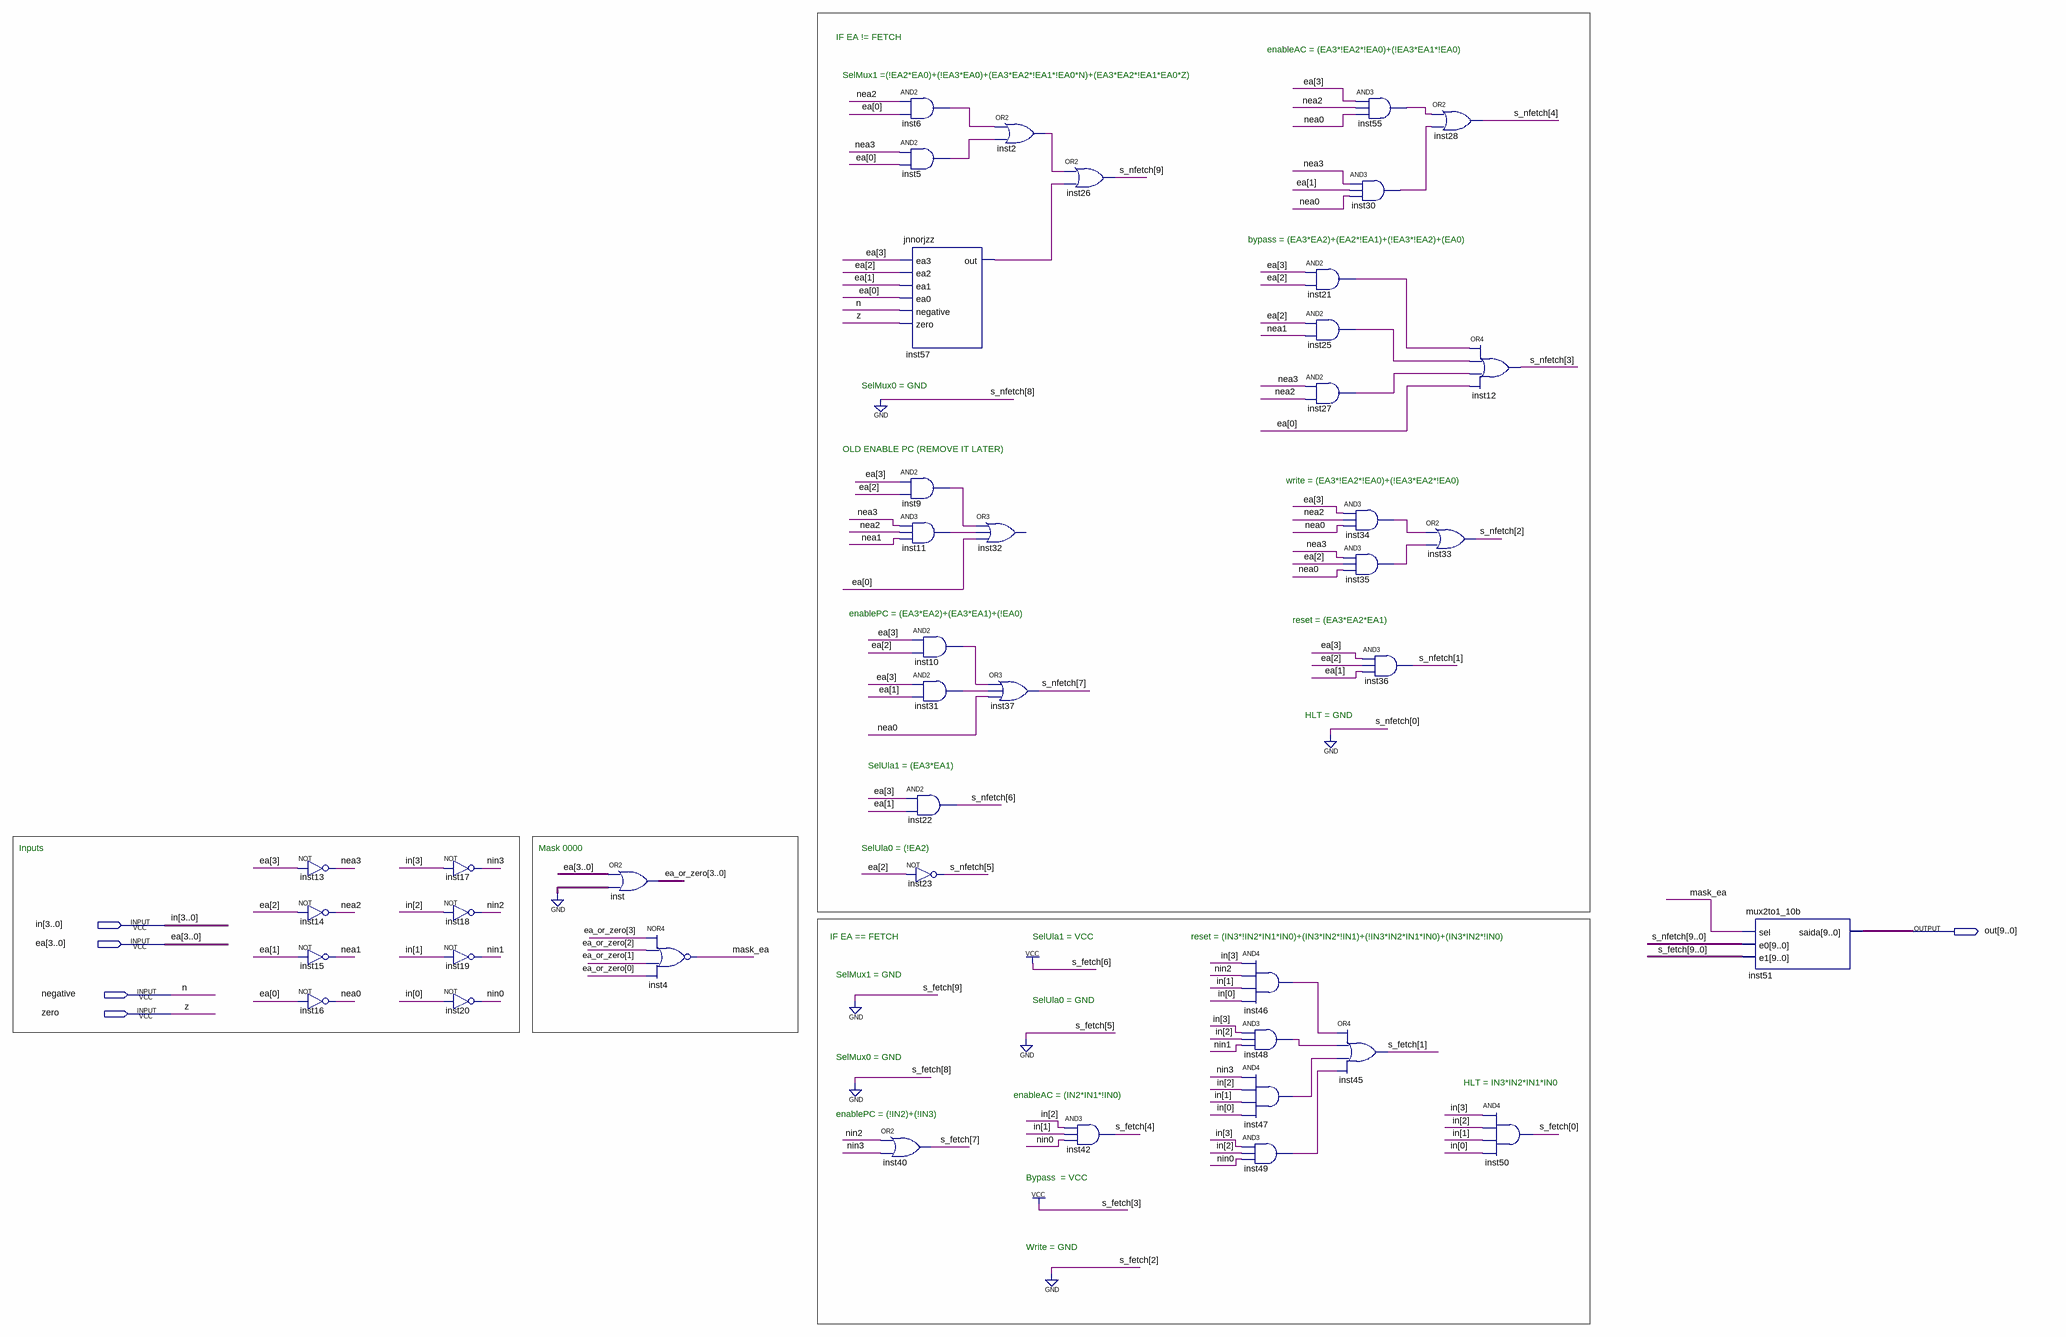
[diagram p0: schematic sheet]
// Quartus schematic ccsaida.bdf as structural Verilog: 43 symbols, 5 pins
module ccsaida (
  input  [3:0] in,
  input  [3:0] ea,
  input  negative,
  input  zero,
  output [9:0] out
);

  wire inst2_out, inst5_out, inst6_out, inst9_out, inst10_out, inst11_out, inst21_out, inst25_out,
       inst27_out, inst30_out, inst31_out, inst34_out, inst35_out, inst46_out, inst47_out, inst48_out,
       inst49_out, inst55_out, inst57_out, mask_ea, nea0, nea1, nea2, nea3, nin0, nin1, nin2, nin3;
  wire [3:0] ea_or_zero;
  wire [7:0] s_fetch;
  wire [9:1] s_nfetch;

  not inst13 (nea3, ea[3]);
  not inst14 (nea2, ea[2]);
  not inst15 (nea1, ea[1]);
  not inst16 (nea0, ea[0]);
  not inst17 (nin3, in[3]);
  not inst18 (nin2, in[2]);
  not inst19 (nin1, in[1]);
  not inst20 (nin0, in[0]);
  assign ea_or_zero = ea | 4'b0000;  // OR2 inst, 4 bits wide
  nor inst4 (mask_ea, ea_or_zero[3], ea_or_zero[2], ea_or_zero[1], ea_or_zero[0]);
  or inst40 (s_fetch[7], nin2, nin3);
  and inst6 (inst6_out, nea2, ea[0]);
  and inst5 (inst5_out, nea3, ea[0]);
  jnnorjzz inst57 (
    .ea3(ea[3]), .ea2(ea[2]), .ea1(ea[1]), .ea0(ea[0]), .negative(negative), .zero(zero), .out(inst57_out));
  and inst9 (inst9_out, ea[3], ea[2]);
  and inst11 (inst11_out, nea3, nea2, nea1);
  and inst10 (inst10_out, ea[3], ea[2]);
  and inst31 (inst31_out, ea[3], ea[1]);
  and inst22 (s_nfetch[6], ea[3], ea[1]);
  not inst23 (s_nfetch[5], ea[2]);
  // OR3 inst32 has open pins: IN1=inst9_out, IN2=inst11_out, IN3=ea[0], OUT=open
  or inst37 (s_nfetch[7], inst10_out, inst31_out, nea0);
  or inst2 (inst2_out, inst6_out, inst5_out);
  or inst26 (s_nfetch[9], inst2_out, inst57_out);
  and inst42 (s_fetch[4], in[2], in[1], nin0);
  and inst46 (inst46_out, in[3], nin2, in[1], in[0]);
  and inst48 (inst48_out, in[3], in[2], nin1);
  and inst47 (inst47_out, nin3, in[2], in[1], in[0]);
  and inst49 (inst49_out, in[3], in[2], nin0);
  and inst21 (inst21_out, ea[3], ea[2]);
  and inst25 (inst25_out, ea[2], nea1);
  and inst27 (inst27_out, nea3, nea2);
  and inst34 (inst34_out, ea[3], nea2, nea0);
  and inst35 (inst35_out, nea3, ea[2], nea0);
  or inst45 (s_fetch[1], inst46_out, inst48_out, inst47_out, inst49_out);
  and inst55 (inst55_out, ea[3], nea2, nea0);
  and inst30 (inst30_out, nea3, ea[1], nea0);
  and inst36 (s_nfetch[1], ea[3], ea[2], ea[1]);
  or inst28 (s_nfetch[4], inst55_out, inst30_out);
  or inst33 (s_nfetch[2], inst34_out, inst35_out);
  or inst12 (s_nfetch[3], inst21_out, inst25_out, inst27_out, ea[0]);
  and inst50 (s_fetch[0], in[3], in[2], in[1], in[0]);
  mux2to1_10b inst51 (
    .sel(mask_ea), .e0({s_nfetch[9], 1'b0, s_nfetch[7:1], 1'b0}),
    .e1({2'b00, s_fetch[7], 2'b10, s_fetch[4], 2'b10, s_fetch[1:0]}), .saida(out));

  // Other names for the same wires on the sheet: n = negative; z = zero

  // Notes on the sheet:
  //   IF EA != FETCH 
  //   enableAC = (EA3*!EA2*!EA0)+(!EA3*EA1*!EA0)
  //   SelMux1 =(!EA2*EA0)+(!EA3*EA0)+(EA3*EA2*!EA1*!EA0*N)+(EA3*EA2*!EA1*EA0*Z)
  //   bypass = (EA3*EA2)+(EA2*!EA1)+(!EA3*!EA2)+(EA0)
  //   SelMux0 = GND
  //   OLD ENABLE PC (REMOVE IT LATER)
  //   write = (EA3*!EA2*!EA0)+(!EA3*EA2*!EA0)
  //   enablePC = (EA3*EA2)+(EA3*EA1)+(!EA0)
  //   reset = (EA3*EA2*EA1)
  //   HLT = GND
  //   SelUla1 = (EA3*EA1)
  //   Inputs
  //   Mask 0000
  //   SelUla0 = (!EA2)
  //   IF EA == FETCH
  //   SelUla1 = VCC
  //   reset = (IN3*!IN2*IN1*IN0)+(IN3*IN2*!IN1)+(!IN3*IN2*IN1*IN0)+(IN3*IN2*!IN0)
  //   SelMux1 = GND
  //   SelUla0 = GND
  //   SelMux0 = GND
  //   HLT = IN3*IN2*IN1*IN0
  //   enableAC = (IN2*IN1*!IN0)
  //   enablePC = (!IN2)+(!IN3)
  //   Bypass  = VCC
  //   Write = GND
endmodule
